# EAGLE design Teensy3 based M&M board (EAGLE 6.4)
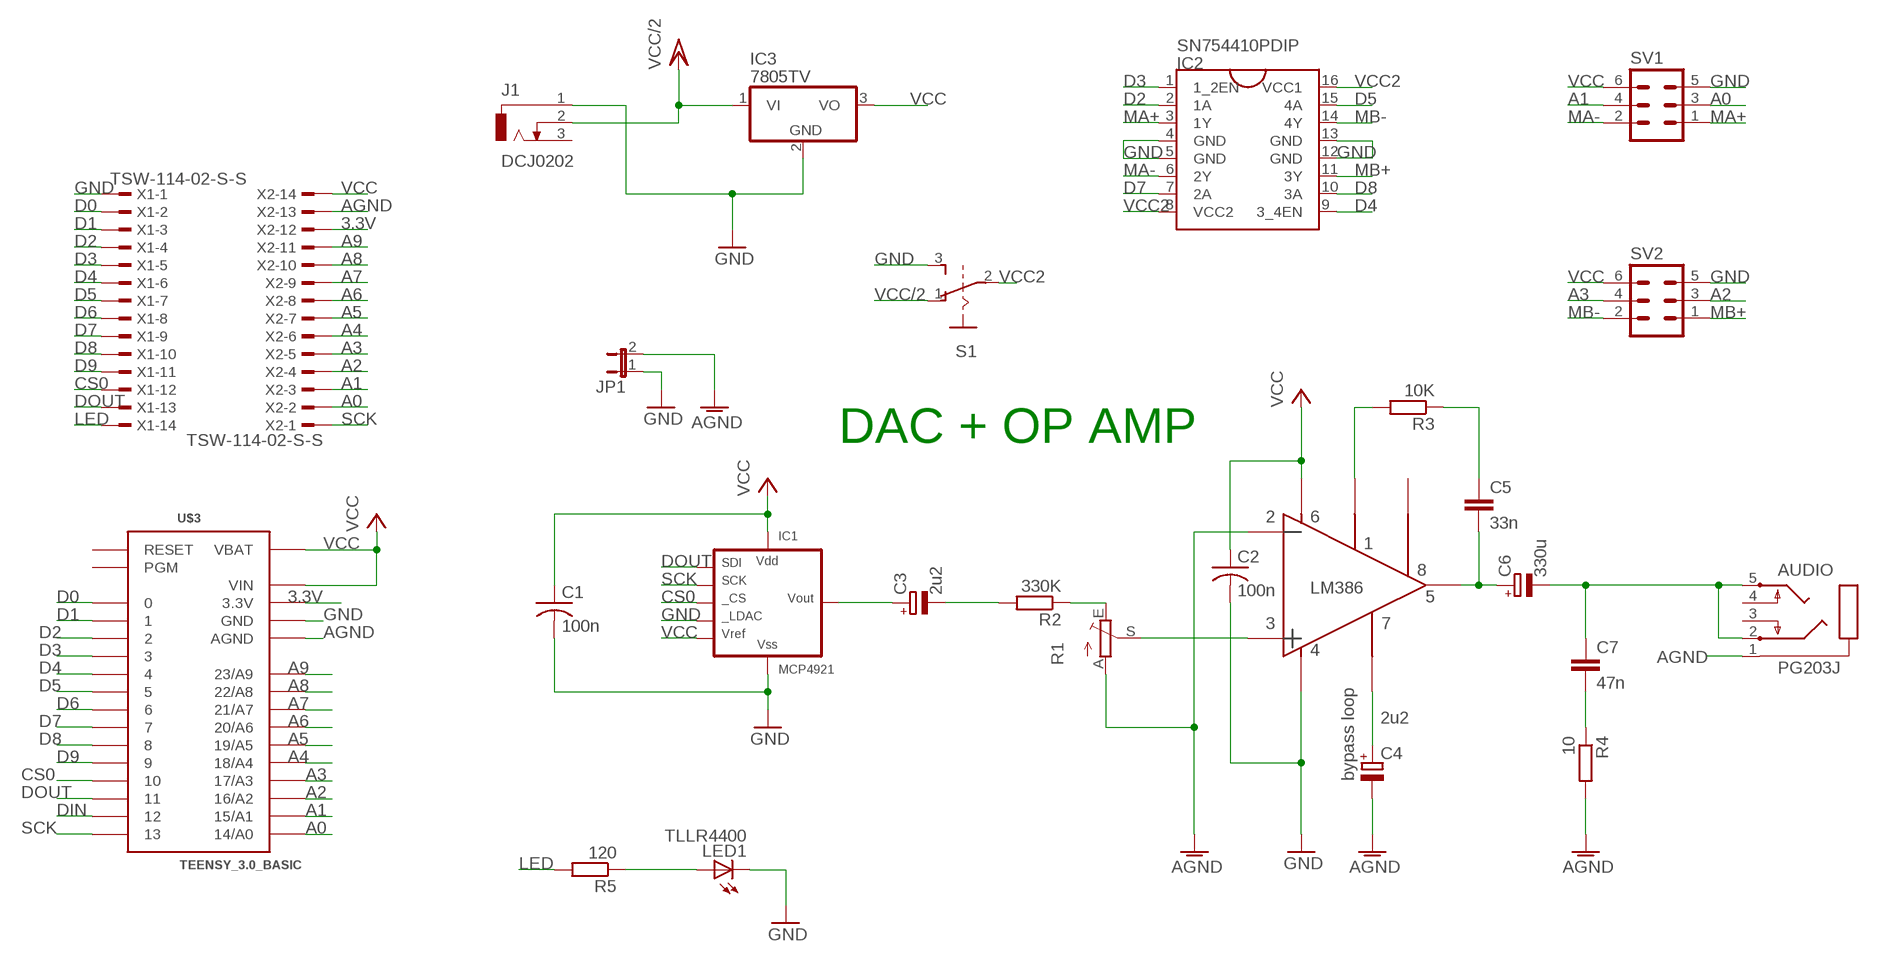
[diagram p0: schematic, sheet 1]

## Parts
AUDIO  PG203J  [PG203J]
C1  100n  C-US050-035X075  [C050-035X075]
C2  100n  C-US050-035X075  [C050-035X075]
C3  2u2  CPOL-EUE2-5  [E2-5]
C4  2u2  CPOL-EUE2-5  [E2-5]
C5  33n  C-EU050-024X044  [C050-024X044]
C6  330u  CPOL-EUE2.5-7  [E2,5-7]
C7  47n  C-EU050-024X044  [C050-024X044]
IC1  MCP4921  MCP4921P  [DIL8]
IC2  SN754410PDIP  [DIL16]
IC3  7805TV  [TO220V]
J1  DCJ0202  [DCJ0202]
JP1  JP1E  [JP1]
LED1  TLLR4400  [LED3MM]
R1  TRIM_EU-CA9V  [CA9V]
R2  330K  R-EU_0207/10  [0207/10]
R3  10K  R-EU_0207/10  [0207/10]
R4  10  R-EU_0207/10  [0207/10]
R5  120  R-EU_0207/10  [0207/10]
S1  EG1218  [GF-126-0159]
SV1  ML6  [ML6]
SV2  ML6  [ML6]
U$2  LM386  LM386OA  [LM386]
U$3  TEENSY_3.0_BASIC  [TEENSY_3.0_BASIC]
X1  TSW-114-02-S-S  [TSW-114-02-S-S]
X2  TSW-114-02-S-S  [TSW-114-02-S-S]

## Nets
3.3V [power]: U$3.3.3V U$3.3.3V1(3.3V) X2.12
A0: SV1.3 U$3.14/A0 X2.2
A1: SV1.4 U$3.15/A1 X2.3
A2: SV2.3 U$3.16/A2 X2.4
A3: SV2.4 U$3.17/A3 X2.5
A4: U$3.18/A4 X2.6
A5: U$3.19/A5 X2.7
A6: U$3.20/A6 X2.8
A7: U$3.21/A7 X2.9
A8: U$3.22/A8 X2.10
A9: U$3.23/A9 X2.11
AGND [power]: AUDIO.1 C4.- JP1.2 R1.A R4.2 U$2.2 U$3.AGND X2.13
CS0: IC1.2(CS) U$3.10 X1.12
D0: U$3.0 X1.2
D1: U$3.1 X1.3
D2: IC2.2(1A) U$3.2 X1.4
D3: IC2.1(1_2EN) U$3.3 X1.5
D4: IC2.9(3_4EN) U$3.4 X1.6
D5: IC2.15(4A) U$3.5 X1.7
D6: U$3.6 X1.8
D7: IC2.7(2A) U$3.7 X1.9
D8: IC2.10(3A) U$3.8 X1.10
D9: U$3.9 X1.11
DIN: U$3.12
DOUT: IC1.4(SDI) U$3.11 X1.13
GND [power]: C1.2 C2.2 IC1.5(LDAC) IC1.7(VSS) IC2.4(GND) IC2.5(GND) IC2.12(GND) IC2.13(GND) IC3.2(GND) J1.1 JP1.1 LED1.K(C) S1.3 SV1.5 SV2.5 U$2.4 U$3.GND U$3.GND1(GND) X1.1
LED: R5.2 X1.14
MA+: IC2.3(1Y) SV1.1
MA-: IC2.6(2Y) SV1.2
MB+: IC2.11(3Y) SV2.1
MB-: IC2.14(4Y) SV2.2
N$1: C3.+ IC1.8(VOUT)
N$2: R3.2 U$2.1
N$3: C3.- R2.2
N$4: R1.E R2.1
N$5: LED1.A R5.1
N$9: C5.1 R3.1
N$10: C4.+ U$2.7
N$78: C7.2 R4.1
N$82: R1.S U$2.3
N$84: AUDIO.2 AUDIO.5 C6.- C7.1
N$99: C5.2 C6.+ U$2.5
SCK: IC1.3(SCK) U$3.13 X2.1
VCC [power]: C1.1 C2.1 IC1.1(VDD) IC1.6(VREF) IC3.3(VO) SV1.6 SV2.6 U$2.6 U$3.VBAT U$3.VIN X2.14
VCC2: IC2.8(VCC2) IC2.16(VCC1) S1.2
VCC/2: IC3.1(VI) J1.2 S1.1
Unconnected: AUDIO.3 AUDIO.4 J1.3 U$2.8 U$3.PGM U$3.RESET

## Notes on the sheet
- DAC + OP AMP
- bypass loop

## Library data of the parts
AUDIO = con-hirschmann:PG203J: MIC/HEADPHONE JACK KS-S stereo microphone/headphone jack PG203JN (Schukat)
C1 C2 = rcl:C-US: CAPACITOR, American symbol
C3 C4 C6 = rcl:CPOL-EU: POLARIZED CAPACITOR, European symbol
C5 C7 = rcl:C-EU: CAPACITOR, European symbol
IC1 = microchip-dac:MCP4921: MCP4921: 12-bit DAC MCP4901/4911/4921 - 8/10/12-Bit Voltage Output Digital-to-Analog Converter with SPI Interface Interface The MCP49x1 devices are single channel 8-bit, 10-bit and 12-bit buffered voltage output Digital-to-Analog Converters (DACs), respectively. The devices operate from a single 2.7V to 5.5V supply with an SPI compatible Serial Peripheral Interface. The user can configure the full-scale range of the device to be VREF or 2*VREF by setting the Gain Selection Option bit (gain of 1 of 2). RobG
IC2 = AlexW-Eagle-Libraries:SN754410
IC3 = linear:78*: Positive VOLTAGE REGULATOR Source: http://cache.national.com/ds/LM/LM78L05.pdf http://www.fairchildsemi.com/ds/LM/LM7805.pdf
J1 = con-jack:DCJ0202: DC POWER JACK Source: DCJ0202.pdf; OC_FARNELL: unknown; OC_NEWARK: unknown
JP1 = jumper:JP1E: JUMPER
LED1 = led:TLLR4400: Low Current (2mA) LED 3 mm Tinted Diffused Package color RED Source: Data sheet <http://www.farnell.com/datasheets/391100.pdf>; MF: VISHAY SEMICONDUCTOR; OC_FARNELL: 1612437
R1 = pot:TRIM_EU-: POTENTIOMETER
R2-R5 = rcl:R-EU_: RESISTOR, European symbol
S1 = videomusik:EG1218
SV1 SV2 = con-harting-ml:ML6: HARTING; OC_FARNELL: unknown; OC_NEWARK: unknown
U$2 = blushingboy_experimental:LM386
U$3 = Teensy3.0:TEENSY_3.0_BASIC: Basic Teensy 3.0 with none of the 'inner' pins enabled. See '+4', 'AllAnalogPins", and 'AllPins' packages for additional pin holes, as needed.
X1 X2 = con-samtec:TSW-114-02-S-S: THROUGH-HOLE .025" SQ POST HEADER Source: Samtec TSW.pdf; OC_FARNELL: unknown; OC_NEWARK: unknown

## Net classes
1 power: width 0.61 mm

## Board
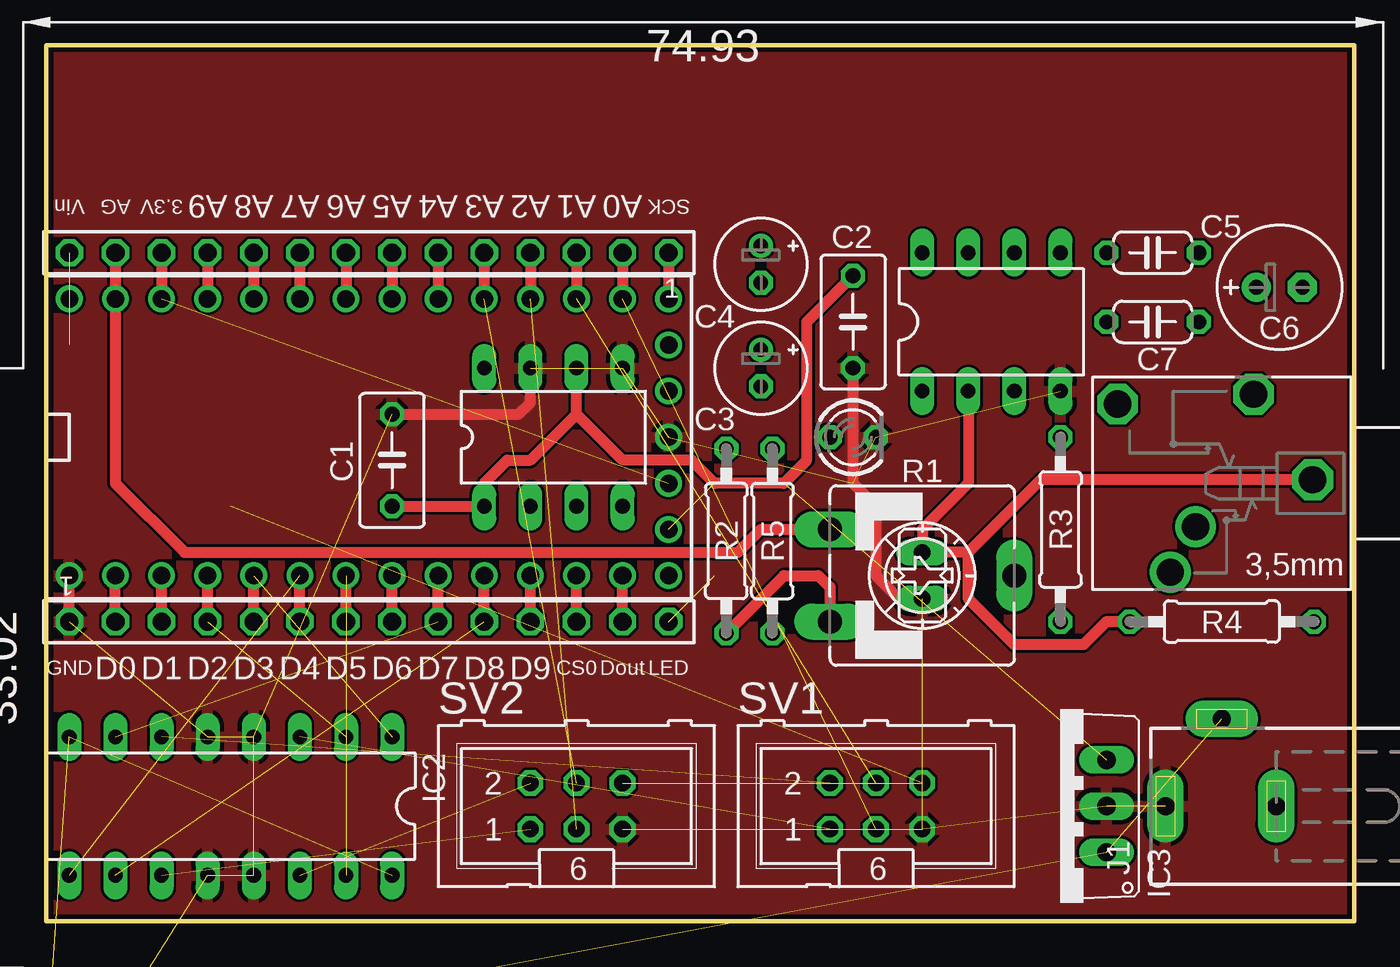
[diagram p1: board, top side]
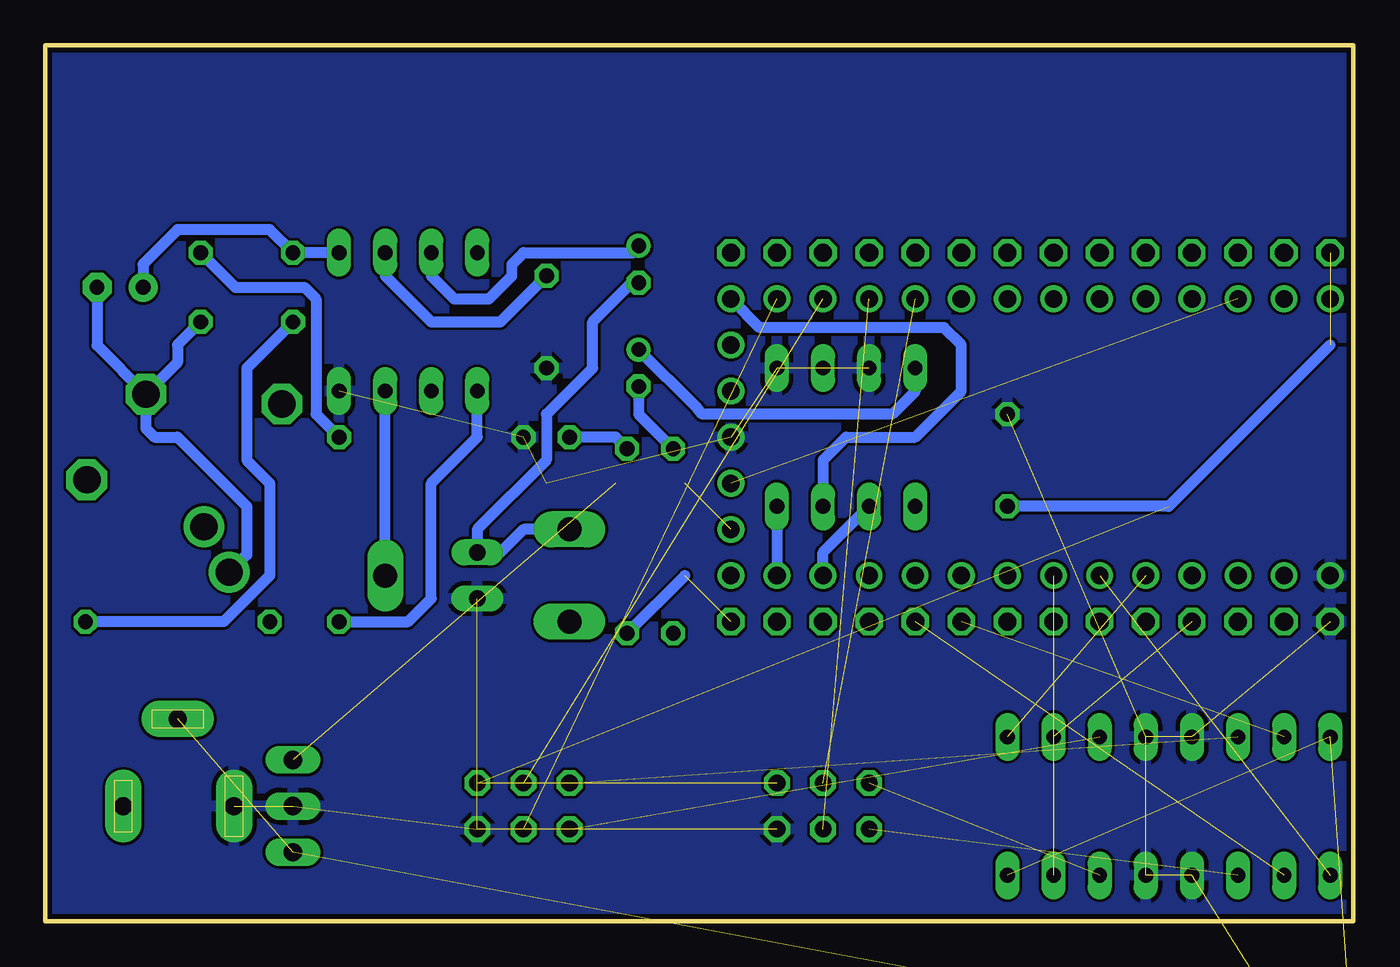
[diagram p2: board, bottom side, seen from below]

Size 72.06 x 48.25 mm. Coordinates in mm from the lower left corner, seen from the top.
Outline: 0,0 72.06,0 72.06,48.25 0,48.25 0,0
Copper layers (1*2*15*16): Top 0.035mm / dielectric 0.2mm / layer 2 0.0175mm / dielectric 1.1mm / layer 15 0.0175mm / dielectric 0.2mm / Bottom 0.035mm
Design rules "SeeedStudio_DRU_no_angle_20130527 *": minimum track width 6mil, minimum drill 12mil, track to track 6mil, track to pad 6mil, pad to pad 6mil, via to via 6mil, smd to smd 0mil, copper to edge 10mil, drill to drill 10mil, minimum pad ring 10mil, minimum via ring 10mil, stop-mask expansion 2mil, vias tented up to drill 25mil, thermal gap 10mil

### Footprints (pad centres in the part's own frame; a part is rotated, then mirrored left to right if it is on the bottom)
PG203J = drill 1.499 octagon: 1 -5.004,-0.203; 4 5.74,-4.369; 5 -1.753,-4.902 | drill 1.499: 2 2.845,4.902; 3 1.448,2.388
C050-035X075 = drill 0.813 octagon: 1 -2.54,0; 2 2.54,0
E2-5 = drill 0.813 pad 1.27: + -1.016,0 | drill 0.813 pad 1.27 octagon: - 1.016,0
C050-024X044 = drill 0.813 octagon: 1 -2.54,0; 2 2.54,0
E2,5-7 = drill 0.813 pad 1.6: + -1.27,0 | drill 0.813 pad 1.6 octagon: - 1.27,0
DIL8 = drill 0.813 long: 1 -3.81,-3.81; 2 -1.27,-3.81; 3 1.27,-3.81; 4 3.81,-3.81; 5 3.81,3.81; 6 1.27,3.81; 7 -1.27,3.81; 8 -3.81,3.81
DIL16 = drill 0.813 long: 1 -8.89,-3.81; 2 -6.35,-3.81; 3 -3.81,-3.81; 4 -1.27,-3.81; 5 1.27,-3.81; 6 3.81,-3.81; 7 6.35,-3.81; 8 8.89,-3.81; 9 8.89,3.81; 10 6.35,3.81; 11 3.81,3.81; 12 1.27,3.81; 13 -1.27,3.81; 14 -3.81,3.81; 15 -6.35,3.81; 16 -8.89,3.81
TO220V = drill 1.016 long: 1 -2.54,-2.54; 2 0,-2.54; 3 2.54,-2.54
DCJ0202 = drill 1 pad 2 long: 1 0,3.1; 2 4.8,0; 3 0,-3
JP1 = drill 0.914 long: 1 0,-1.27; 2 0,1.27
LED3MM = drill 0.813 octagon: A -1.27,0; K 1.27,0
CA9V = drill 1.321 long: A -2.54,-5.08; E 2.54,-5.08; S 0,5.08
0207/10 = drill 0.813 octagon: 1 -5.08,0; 2 5.08,0
GF-126-0159 = drill 1 long: 1 -2.5,0; 2 0,0; 3 2.5,0
ML6 = drill 0.914 octagon: 1 -2.54,-1.27; 2 -2.54,1.27; 3 0,-1.27; 4 0,1.27; 5 2.54,-1.27; 6 2.54,1.27
LM386 = drill 0.813 long: 1 2.54,-2.54; 2 5.08,-2.54; 3 7.62,-2.54; 4 10.16,-2.54; 5 10.16,5.08; 6 7.62,5.08; 7 5.08,5.08; 8 2.54,5.08
TEENSY_3.0_BASIC = drill 0.965: 0 -7.62,13.97; 1 -7.62,11.43; 2 -7.62,8.89; 3 -7.62,6.35; 3.3V 7.62,11.43; 3.3V1 -2.54,-16.51; 4 -7.62,3.81; 5 -7.62,1.27; 6 -7.62,-1.27; 7 -7.62,-3.81; 8 -7.62,-6.35; 9 -7.62,-8.89; 10 -7.62,-11.43; 11 -7.62,-13.97; 12 -7.62,-16.51; 13 7.62,-16.51; 14/A0 7.62,-13.97; 15/A1 7.62,-11.43; 16/A2 7.62,-8.89; 17/A3 7.62,-6.35; 18/A4 7.62,-3.81; 19/A5 7.62,-1.27; 20/A6 7.62,1.27; 21/A7 7.62,3.81; 22/A8 7.62,6.35; 23/A9 7.62,8.89; AGND 7.62,13.97; GND -7.62,16.51; GND1 0,-16.51; PGM 2.54,-16.51; RESET 5.08,-16.51; VBAT -5.08,-16.51; VIN 7.62,16.51
TSW-114-02-S-S = drill 1 pad 1.5 octagon: 1 16.51,0; 2 13.97,0; 3 11.43,0; 4 8.89,0; 5 6.35,0; 6 3.81,0; 7 1.27,0; 8 -1.27,0; 9 -3.81,0; 10 -6.35,0; 11 -8.89,0; 12 -11.43,0; 13 -13.97,0; 14 -16.51,0

### Placement (x,y rotation side)
AUDIO  64.77,24.13 180 top
C1  19.05,25.4 90 top
C2  44.45,33.02 270 top
C3  39.37,30.48 270 top
C4  39.37,36.2 270 top
C5  60.96,36.83 180 top
C6  67.94,34.92 0 top
C7  60.96,33.02 180 top
IC1  27.94,26.67 0 top
IC2  10.16,6.35 180 top
IC3  55.88,6.35 90 top
J1  64.77,6.35 90 top
JP1  48.26,19.05 0 top
LED1  44.45,26.67 0 top
R1  48.26,19.05 270 top
R2  37.47,20.95 90 top
R3  55.88,21.59 270 top
R4  64.77,16.51 180 top
R5  40.01,20.95 270 top
S1  0,-7.62 0 top  (outside the outline)
SV1  45.72,6.35 0 top
SV2  29.21,6.35 0 top
U$2  45.72,31.75 0 top
U$3  17.78,26.67 90 top
X1  17.78,16.51 180 top
X2  17.78,36.83 0 top

### Tracks (layer width: path | path; a pad name or v marks a point on that pad's centre or on a via)
3.3V  (1 unrouted)
  Top 0.61: X2.12 U$3.3.3V
A0  (1 unrouted)
  Top 0.61: X2.2 U$3.14/A0
A1  (1 unrouted)
  Top 0.61: X2.3 U$3.15/A1
A2  (1 unrouted)
  Top 0.61: X2.4 U$3.16/A2
A3  (1 unrouted)
  Top 0.61: X2.5 U$3.17/A3
A4
  Top 0.61: X2.6 U$3.18/A4
A5
  Top 0.61: X2.7 U$3.19/A5
A6
  Top 0.61: X2.8 U$3.20/A6
A7
  Top 0.61: X2.9 U$3.21/A7
A8
  Top 0.61: X2.10 U$3.22/A8
A9
  Top 0.61: X2.11 U$3.23/A9
AGND
  Top 0.61: U$2.2 50.8,24.13 48.26,21.59 JP1.2 50.8,20.32 | AUDIO.1 54.81,24.33 50.8,20.32 | R4.2 58.42,16.51 57.15,15.24 53.34,15.24 50.8,17.78 50.8,20.32 | X2.13 U$3.AGND 3.81,24.13 7.62,20.32 38.1,20.32 39.37,21.59 R1.A
  Bottom 0.61: R1.A 45.72,21.59 46.99,20.32 JP1.2 48.26,21.59 44.45,25.4 44.45,27.94 41.91,30.48 41.91,33.02 39.75,35.18 C4.-
CS0
  Top 0.61: X1.12 U$3.10
  Bottom 0.61: U$3.10 29.21,20.32 IC1.2
D0
  Top 0.61: X1.2 U$3.0
D1
  Top 0.61: X1.3 U$3.1
D2  (1 unrouted)
  Top 0.61: X1.4 U$3.2
D3  (1 unrouted)
  Top 0.61: X1.5 U$3.3
D4  (1 unrouted)
  Top 0.61: X1.6 U$3.4
D5  (1 unrouted)
  Top 0.61: X1.7 U$3.5
D6
  Top 0.61: X1.8 U$3.6
D7  (1 unrouted)
  Top 0.61: X1.9 U$3.7
D8  (1 unrouted)
  Top 0.61: X1.10 U$3.8
D9
  Top 0.61: X1.11 U$3.9
DOUT
  Top 0.61: X1.13 U$3.11
  Bottom 0.61: IC1.4 U$3.11
GND  (15 unrouted)
  Top 0.61: C1.2 26.04,27.94 26.67,28.57 IC1.7 | C2.2 44.45,24.13 45.72,22.86 45.72,19.05 46.99,17.78 JP1.1 | X1.1 U$3.GND
  pour Bottom: -1.27,-2.54 -1.27,49.53 73.66,49.53 73.66,-2.54
  pour Top: 0,49.53 -1.27,-2.54 73.66,-2.54 74.93,49.53
LED  (1 unrouted)
  Bottom 0.61: 36.83,19.05 R5.2
MA+  (1 unrouted)
MA-  (1 unrouted)
MB+  (1 unrouted)
MB-  (1 unrouted)
N$1
  Bottom 0.61: IC1.8 24.13,29.21 25.4,27.94 35.88,27.94 36.2,28.32 C3.+
N$2
  Bottom 0.61: R3.2 52.07,16.51 50.8,17.78 50.8,24.13 48.26,26.67 U$2.1
N$3
  Bottom 0.61: C3.- 39.37,27.94 R2.2
N$4
  Top 0.61: R2.1 40.64,19.05 42.55,19.05 43.18,18.41 R1.E
N$5
  Bottom 0.61: R5.1 40.64,26.67 LED1.A
N$9
  Bottom 0.61: C5.1 61.59,34.92 57.78,34.92 57.15,34.29 57.15,27.94 R3.1
N$10
  Bottom 0.61: U$2.7 50.8,35.56 49.53,34.29 47.62,34.29 46.35,35.56 46.35,36.2 45.72,36.83 39.62,36.83 39.62,36.96 C4.+
N$78
  Bottom 0.61: C7.2 60.96,30.48 60.96,25.4 59.69,24.13 59.69,19.05 62.23,16.51 R4.1
N$82
  Bottom 0.61: R1.S U$2.3
N$84
  Bottom 0.61: C6.- 69.22,31.72 AUDIO.5 | C7.1 64.77,31.75 64.77,30.79 AUDIO.5 | AUDIO.5 66.52,27.15 66.04,26.67 64.77,26.67 60.96,22.86 60.96,20.19 AUDIO.2
N$99
  Bottom 0.61: U$2.5 C5.2 59.69,38.1 64.77,38.1 66.67,36.2 C6.+
SCK
  Top 0.61: X2.1 U$3.13
  Bottom 0.61: U$3.13 32.7,32.7 22.54,32.7 21.59,31.75 21.59,29.21 24.13,26.67 27.94,26.67 29.21,25.4 IC1.3
VCC  (6 unrouted)
  Top 0.61: C1.1 IC1.1 24.13,24.13 25.4,25.4 26.67,25.4 29.21,27.94 | C2.1 41.91,33.02 41.91,25.4 40.64,24.13 36.83,24.13 35.56,25.4 31.75,25.4 29.21,27.94 | 29.21,27.94 IC1.6
  Bottom 0.61: U$2.6 53.34,35.56 50.8,33.02 46.99,33.02 C2.1 | 1.27,31.75 10.16,22.86 C1.1
VCC2  (2 unrouted)
VCC/2  (2 unrouted)

### Text on the board
_tsilk: Vin | AG | 3.3V | A9 | A8 | A7 | A6 | A5 | A4 | A3 | A2 | A1 | A0 | SCK | GND | D0 | D1 | D2 | D3 | D4 | D5 | D6 | D7 | D8 | D9 | CS0 | Dout | LED